# EAGLE design Spannungsregulator+stromueberhohung (EAGLE 6.1)
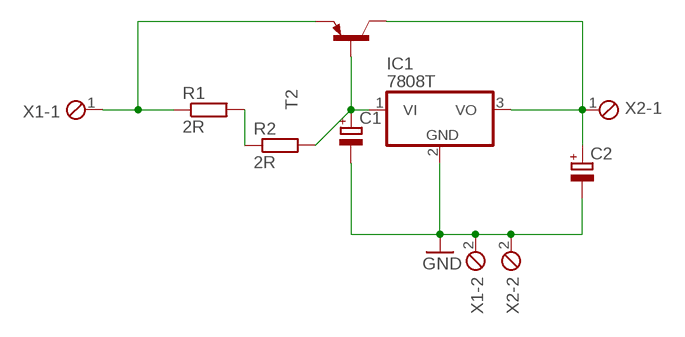
[diagram p0: schematic, sheet 1]

## Parts
C1  CPOL-EUE2,5-6E  [E2,5-6E]
C2  CPOL-EUE2,5-6E  [E2,5-6E]
IC1  7808T  [TO220H]
R1  2R  R-EU_0204/7  [0204/7]
R2  2R  R-EU_0204/7  [0204/7]
T2  -PNP-TO220V  [TO220V]
X1  MPT2  [2POL254]
X2  MPT2  [2POL254]

## Nets
GND: C1.- C2.- IC1.2(GND) X1.2 X2.2
N$1: R1.2 R2.1
N$2: C1.+ IC1.1(VI) R2.2 T2.1(B)
N$3: R1.1 T2.3(E) X1.1
N$6: C2.+ IC1.3(VO) T2.2(C) X2.1

## Library data of the parts
C1 C2 = resistor:CPOL-EU: POLARIZED CAPACITOR, European symbol
IC1 = linear:78*: Positive VOLTAGE REGULATOR Source: http://cache.national.com/ds/LM/LM78L05.pdf http://www.fairchildsemi.com/ds/LM/LM7805.pdf
R1 R2 = resistor:R-EU_: RESISTOR, European symbol
T2 = transistor:*-PNP-: PNP Transistror
X1 X2 = con-phoenix-254:MPT2: PHOENIX CONNECTOR; OC_FARNELL: unknown; OC_NEWARK: unknown

## Board
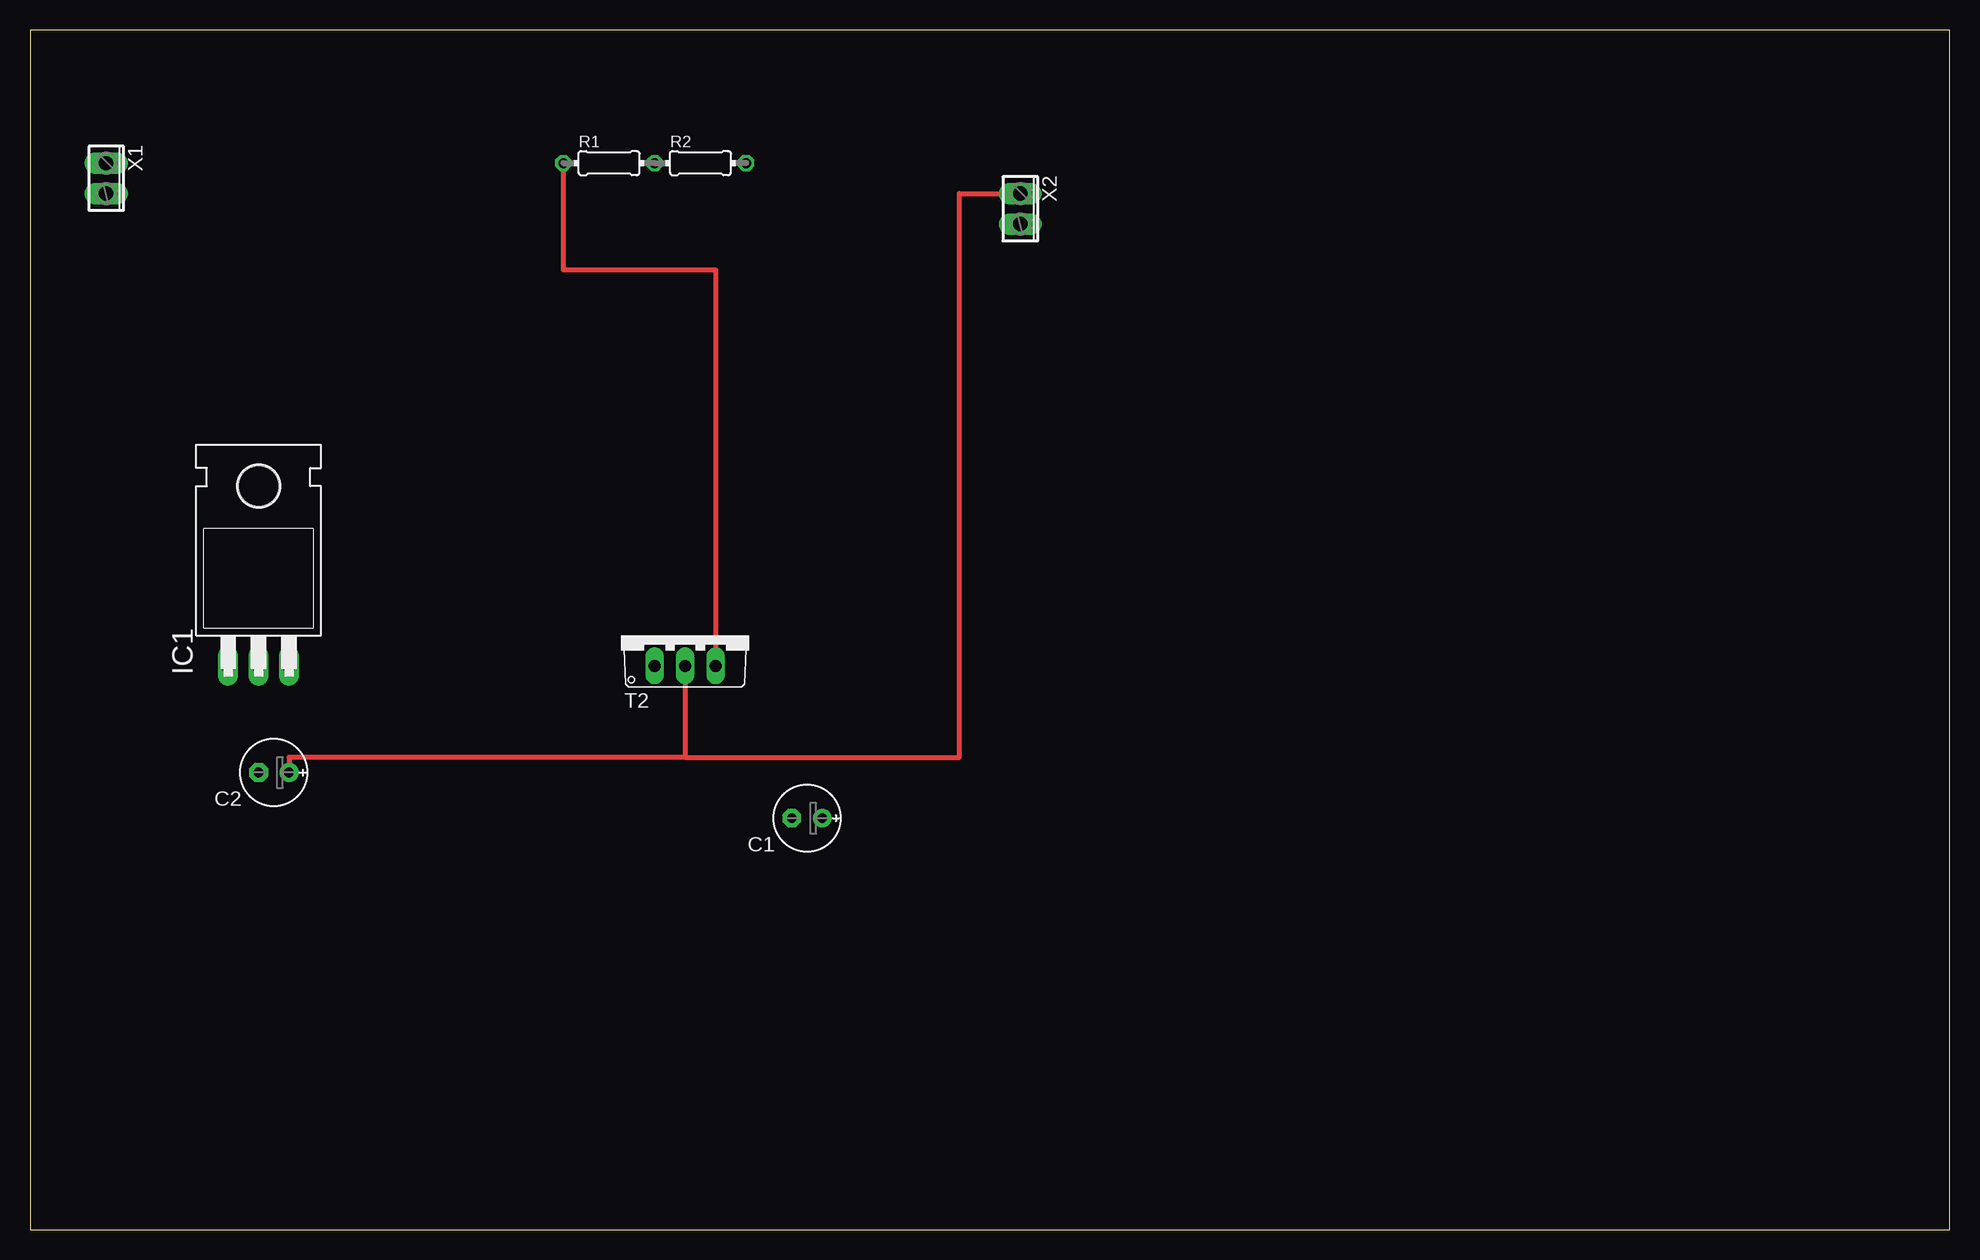
[diagram p1: board, top side]
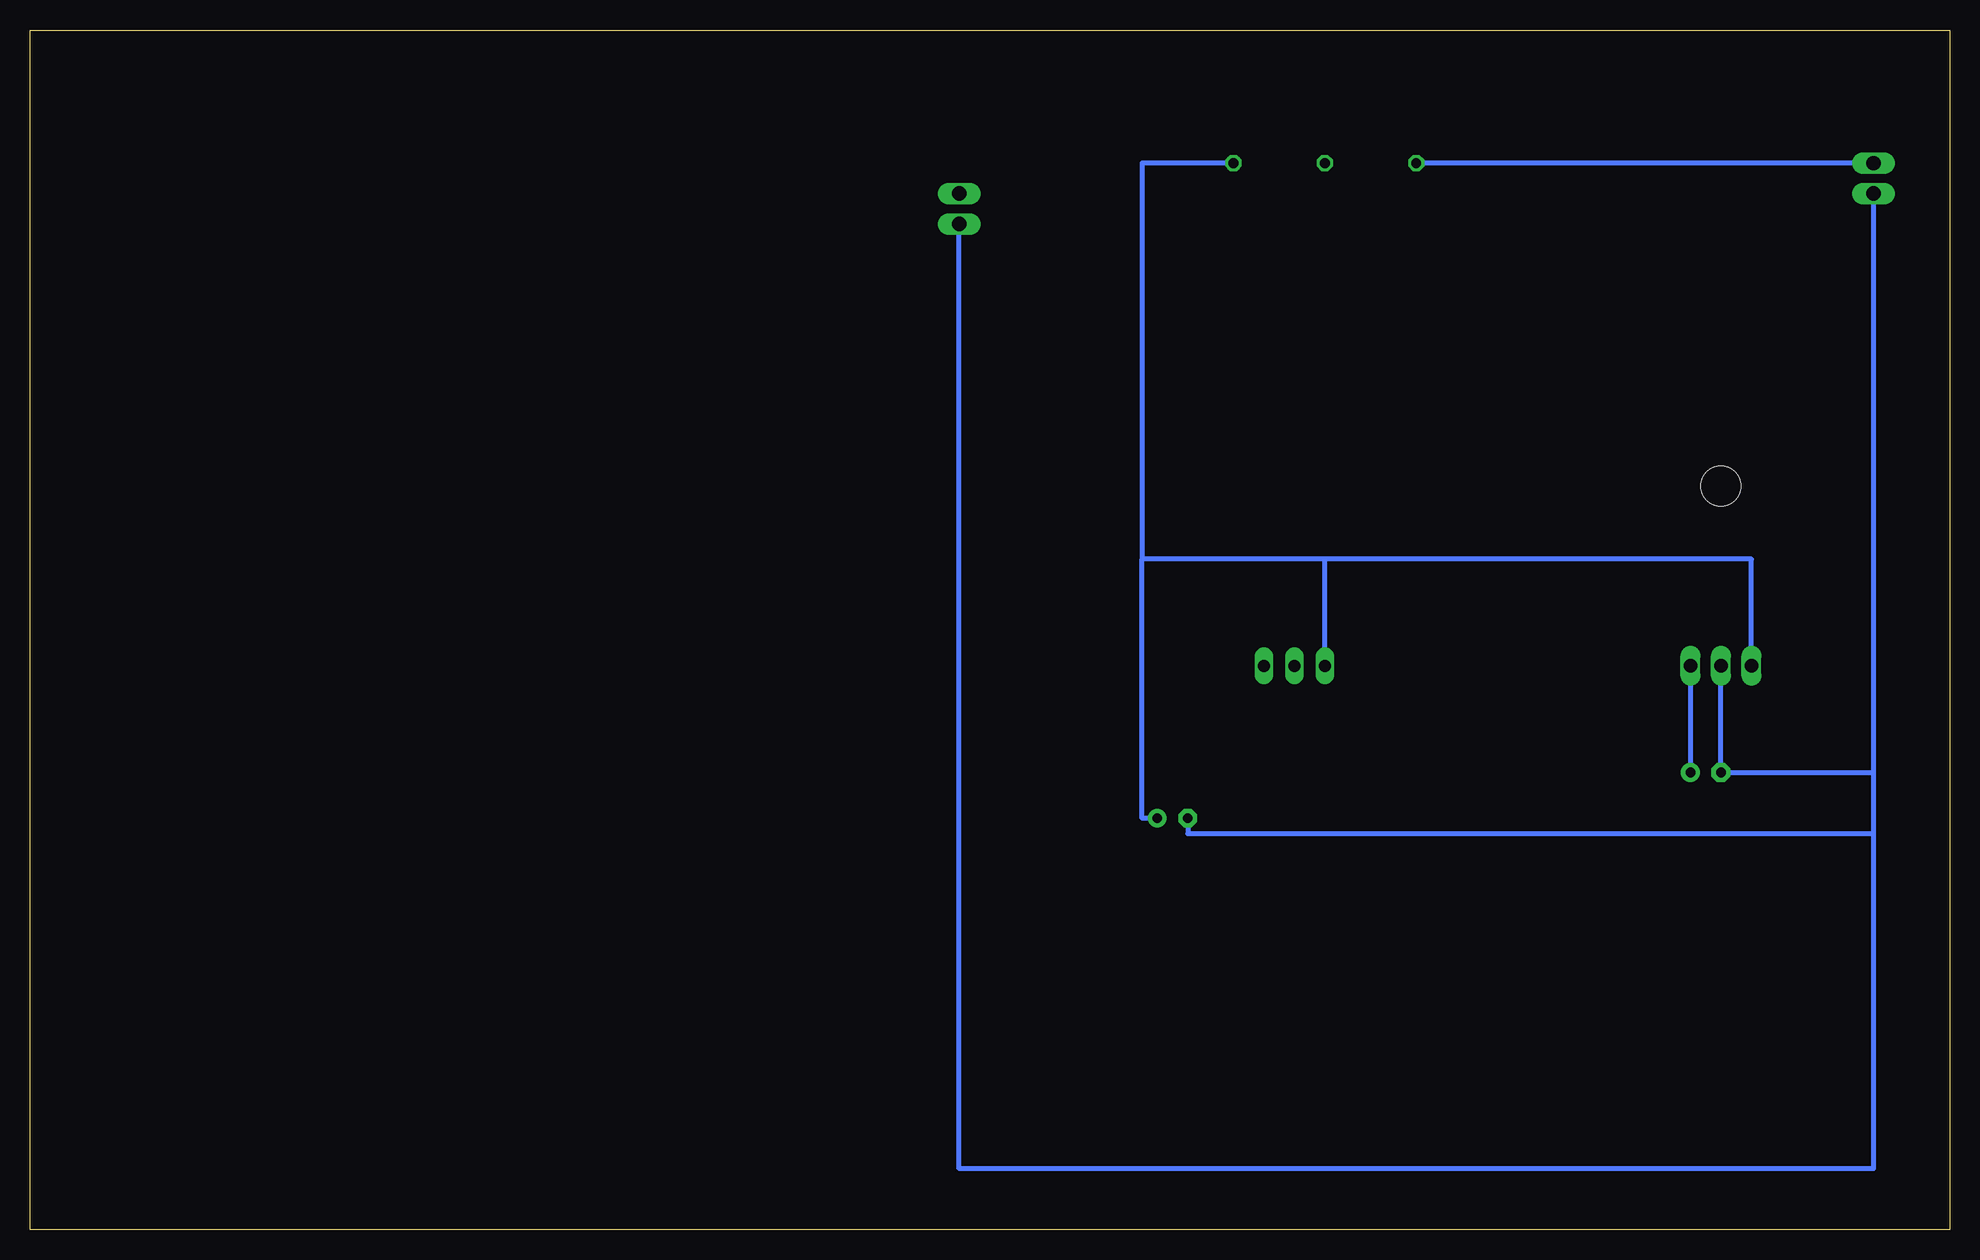
[diagram p2: board, bottom side, seen from below]

Size 160 x 100 mm. Coordinates in mm from the lower left corner, seen from the top.
Outline: 0,0 160,0 160,100 0,100 0,0
Copper layers (1*16): Top 0.035mm / dielectric 1.5mm / Bottom 0.035mm
Design rules: minimum track width 10mil, minimum drill 24mil, track to track 8mil, track to pad 8mil, pad to pad 8mil, via to via 8mil, smd to smd 8mil, copper to edge 40mil, drill to drill 8mil, minimum pad ring 10mil, minimum via ring 8mil, stop-mask expansion 4mil, vias tented up to drill 0mil, thermal gap 10mil

### Footprints (pad centres in the part's own frame; a part is rotated, then mirrored left to right if it is on the bottom)
E2,5-6E = drill 0.813 pad 1.575: + -1.27,0 | drill 0.813 pad 1.575 octagon: - 1.27,0
TO220H = drill 1.118 long: 1 -2.54,-10.16; 2 0,-10.16; 3 2.54,-10.16 | hole 3.302: 0,4.826
0204/7 = drill 0.813 octagon: 1 -3.81,0; 2 3.81,0
TO220V = drill 1.016 long: 1 -2.54,-2.54; 2 0,-2.54; 3 2.54,-2.54
2POL254 = drill 1.2 long: 1 -1.27,0; 2 1.27,0

### Placement (x,y rotation side)
C1  64.77,34.29 180 top
C2  20.32,38.1 180 top
IC1  19.05,57.15 0 top
R1  48.26,88.9 0 top
R2  55.88,88.9 0 top
T2  54.61,49.53 0 top
X1  6.35,87.63 270 top
X2  82.55,85.09 270 top

### Tracks (layer width: path | path; a pad name or v marks a point on that pad's centre or on a via)
GND
  Bottom 0.406: IC1.2 C2.- 6.35,38.1 | X1.2 6.35,38.1 | 6.35,38.1 6.35,33.02 | C1.- 63.5,33.02 6.35,33.02 | 6.35,33.02 6.35,5.08 82.55,5.08 X2.2
N$2  (via drill 0.6)
  Bottom 0.406: IC1.1 16.51,55.88 52.07,55.88 | 52.07,55.88 67.31,55.88 | R2.2 67.31,88.9 67.31,55.88 | C1.+ 67.31,34.29 67.31,55.88 | T2.1 52.07,55.88
  other vias: 59.69,88.9
N$3
  Top 0.406: R1.1 44.45,80.01 57.15,80.01 T2.3
  Bottom 0.406: X1.1 R1.1
N$6
  Top 0.406: 54.61,39.37 77.47,39.37 77.47,86.36 X2.1 | T2.2 54.61,39.37 | 54.61,39.37 21.59,39.37 C2.+
  Bottom 0.406: IC1.3 C2.+